# EAGLE design RFID_USB_Reader-v18 (EAGLE 9.1.0)
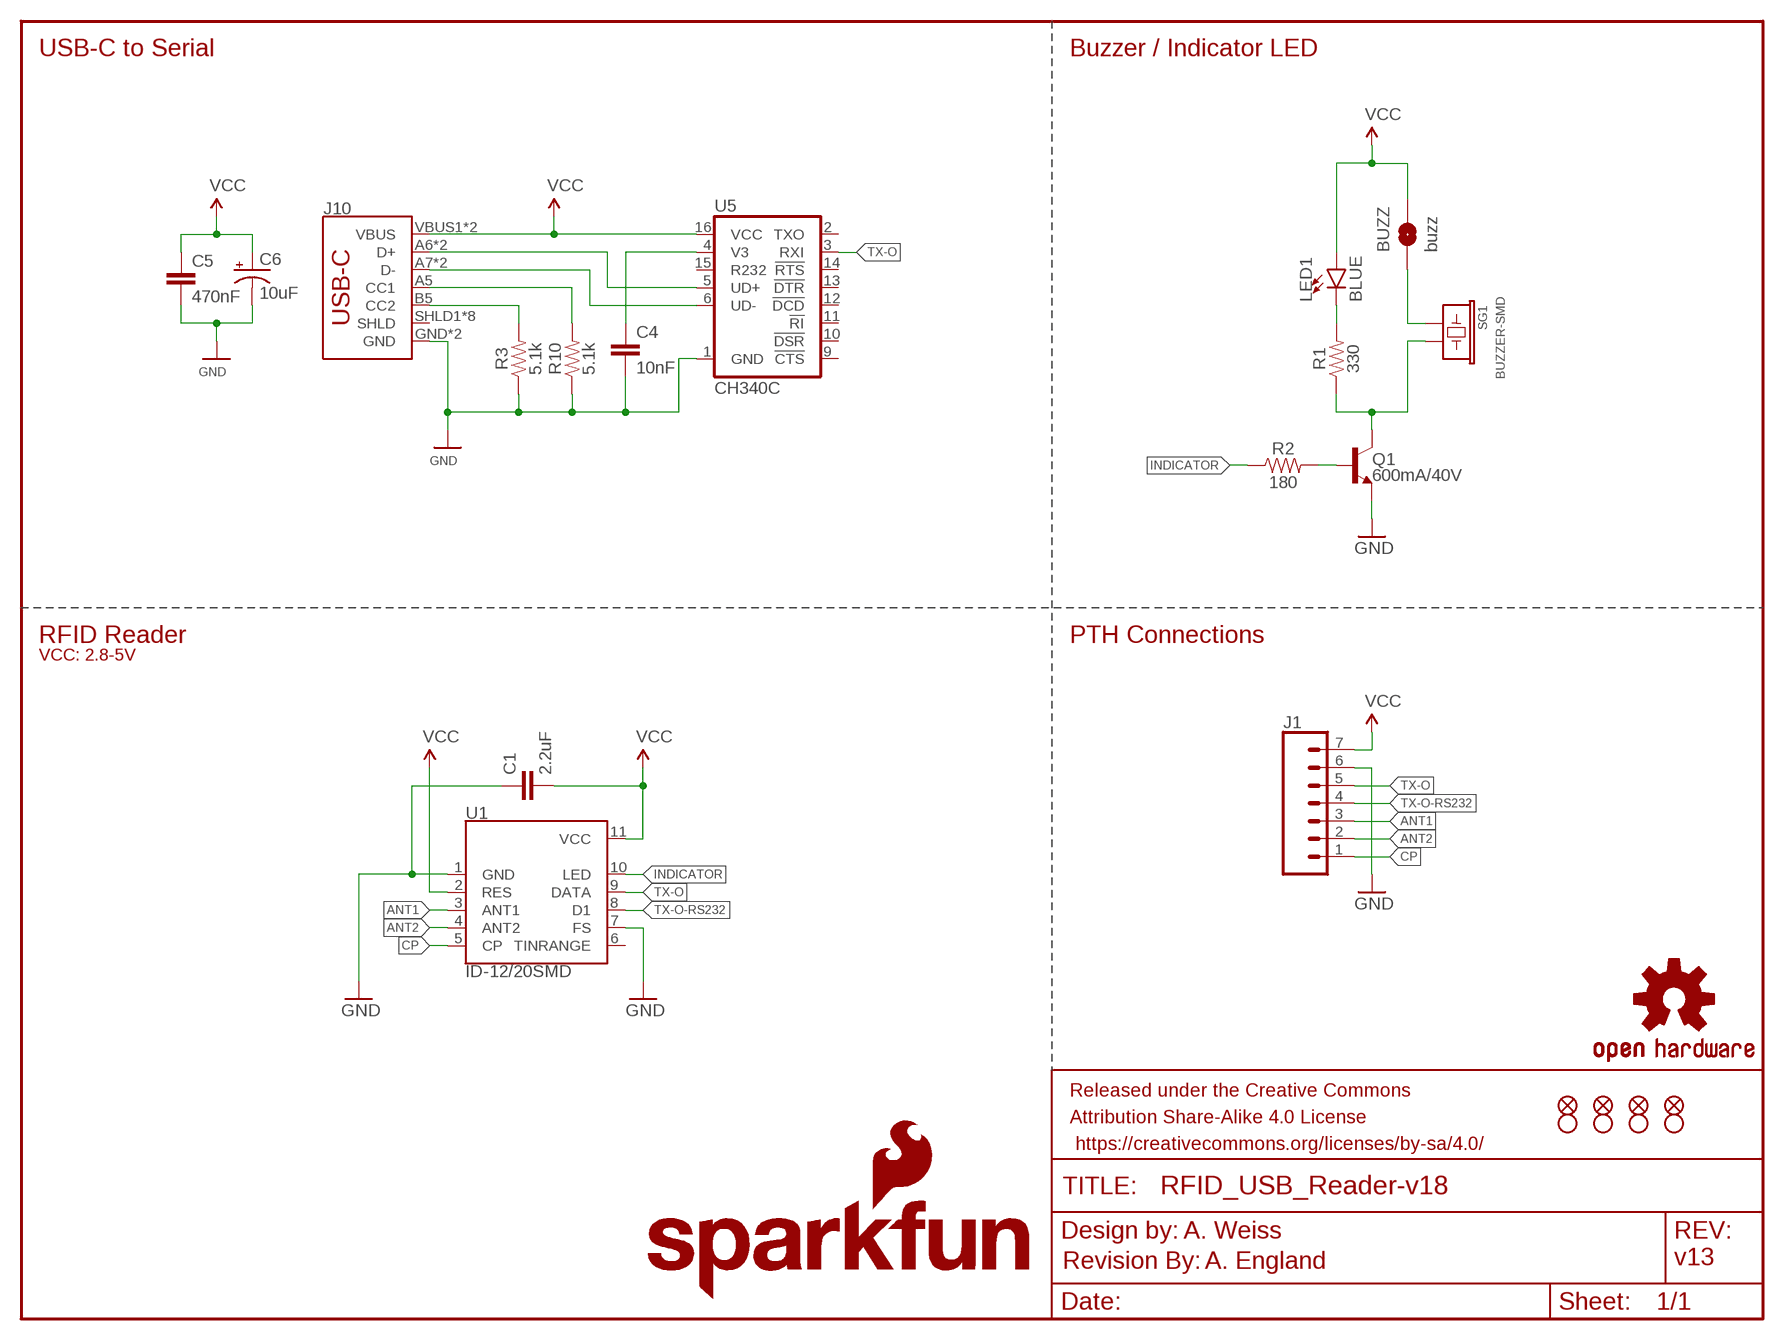
[diagram p0: schematic, sheet 1]

## Parts
BUZZ  buzz  JUMPER-SMT_2_NO_NO-SILK  [SMT-JUMPER_2_NO_NO-SILK]
C1  2.2uF  2.2UF-0603-10V-20%  [0603]
C4  10nF  10NF-0603-50V-10%  [0603]
C5  470nF  470NF-0603-10V-10%-X5R  [0603]
C6  10uF  10UF-POLAR-0603-6.3V-20%(TANT)  [0603-POLAR]
FRAME1  FRAME-LETTER  [CREATIVE_COMMONS]
J1  CONN_07  [1X07]
J10  USB_C2-LAYER  [USB-C-16P]
JP1  FIDUCIAL1X2  [FIDUCIAL-1X2]
JP2  FIDUCIAL1X2  [FIDUCIAL-1X2]
JP3  FIDUCIAL1X2  [FIDUCIAL-1X2]
JP5  FIDUCIAL1X2  [FIDUCIAL-1X2]
LED1  BLUE  LED-BLUE0603  [LED-0603]
LOGO1  SFE_LOGO_NAME_FLAME.1_INCH  [SFE_LOGO_NAME_FLAME_.1]
LOGO2  SFE_LOGO_NAME_FLAME.1_INCH  [SFE_LOGO_NAME_FLAME_.1]
LOGO3  OSHW-LOGOS  [OSHW-LOGO-S]
LOGO4  REVISION  [REVISION]
Q1  600mA/40V  TRANS_NPN-MMBT2222AL  [SOT23-3]
R1  330  330OHM-0603-1/10W-1%  [0603]
R2  180  180OHM-0603-1/10W-1%  [0603]
R3  5.1k  5.1KOHM5.1KOHM-0603-1/10W-1%  [0603]
R10  5.1k  5.1KOHM5.1KOHM-0603-1/10W-1%  [0603]
SG1  BUZZER-SMD  [BUZZER-CCV]
U1  ID-12/20SMD  [ID-12_SMD]
U5  CH340C  [SO016]
U$4  STAND-OFF  [STAND-OFF]
U$5  STAND-OFF  [STAND-OFF]
U$6  STAND-OFF  [STAND-OFF]
U$7  STAND-OFF  [STAND-OFF]

## Nets
ANT1: J1.3 U1.3(ANT1)
ANT2: J1.2 U1.4(ANT2)
CP: J1.1 U1.5(CP)
GND: C1.1 C4.2 C5.2 C6.- J1.6 J10.GND J10.GND2(GND) Q1.2(E) R3.1 R10.1 U1.1(GND) U1.7(FS) U5.1(GND)
INDICATOR: R2.1 U1.10(LED)
N$1: Q1.3(C) R1.1 SG1.-
N$2: C4.1 U5.4(V3)
N$3: J10.A6(D+) J10.B6(D+) U5.5(UD+)
N$4: BUZZ.1 SG1.+
N$6: J10.A5(CC1) R10.2
N$7: LED1.C R1.2
N$8: Q1.1(B) R2.2
N$9: J10.A7(D-) J10.B7(D-) U5.6(UD-)
N$11: J10.B5(CC2) R3.2
TX-O: J1.5 U1.9(DATA) U5.3(RXI)
TX-O-RS232: J1.4 U1.8(D1)
VCC: BUZZ.2 C1.2 C5.1 C6.+ J1.7 J10.VBUS1(VBUS) J10.VBUS2(VBUS) LED1.A U1.2(RES) U1.11(VCC) U5.16(VCC)
Unconnected: J10.SHLD1(SHLD) J10.SHLD2(SHLD) J10.SHLD3(SHLD) J10.SHLD4(SHLD) J10.SHLD5(SHLD) J10.SHLD6(SHLD) J10.SHLD7(SHLD) J10.SHLD8(SHLD) U1.6(TINRANGE) U5.2(TXO) U5.9(!CTS) U5.10(!DSR) U5.11(!RI) U5.12(!DCD) U5.13(!DTR) U5.14(!RTS) U5.15(R232)

## Notes on the sheet
- USB-C to Serial | Buzzer / Indicator LED
- RFID Reader | PTH Connections
- VCC: 2.8-5V
- A. Weiss
- A. England | v13

## Library data of the parts
BUZZ = SparkFun-Jumpers:JUMPER-SMT_2_NO: Normally open jumper This jumper has two pads in close proximity to each other. Apply solder to close the connection. Round pads are easier to solder for beginners, but are a lot larger. SparkFun Product that uses the round pads: SparkFun EL Sequencer <https://www.sparkfun.com/products/12781>
C1 = SparkFun-Capacitors:2.2UF: 2.2µF ceramic capacitors A capacitor is a passive two-terminal electrical component used to store electrical energy temporarily in an electric field.; PROD_ID: CAP-07888
C4 = SparkFun-Capacitors:10NF: 0.01uF/10nF/10,000pF ceramic capacitors A capacitor is a passive two-terminal electrical component used to store electrical energy temporarily in an electric field. CAP-09321; PROD_ID: CAP-00867
C5 = SparkFun-Capacitors:470NF: 0.47uF/470nF ceramic capacitors A capacitor is a passive two-terminal electrical component used to store electrical energy temporarily in an electric field.; PROD_ID: CAP-13216
C6 = SparkFun-Capacitors:10UF-POLAR: 10.0µF polarized capacitors A capacitor is a passive two-terminal electrical component used to store electrical energy temporarily in an electric field.; PROD_ID: CAP-13210
FRAME1 = SparkFun-Aesthetics:FRAME-LETTER: Schematic Frame - Letter Standard 8.5x11 US Letter frame
J1 = SparkFun-Connectors:CONN_07: Multi connection point. Often used as Generic Header-pin footprint for 0.1 inch spaced/style header connections On any of the 0.1 inch spaced packages, you can populate with these: Break Away Headers - Straight <https://www.sparkfun.com/products/116> (PRT-00116) Break Away Male Headers - Right Angle <https://www.sparkfun.com/products/553> (PRT-00553) Female Headers <https://www.sparkfun.com/products/115> (PRT-00115) Break Away Headers - Machine Pin <https://www.sparkfun.com/products/117> (PRT-00117) Break Away Female Headers - Swiss Machine Pin <https://www.sparkfun.com/products/743> (PRT-00743) For SCREWTERMINALS and SPRING TERMINALS visit here: Screw Terimnals on SparkFun.com <https://www.sparkfun.com/search/results?term=Screw+Terminals> (5mm/3.5mm/2.54mm spacing) This device is also useful as a general connection point to wire up your design to another part of your project. Our various solder wires solder well into these plated through hole pads. Hook-Up Wire - Assortment (Stranded, 22 AWG) <https://www.sparkfun.com/products/11375> (PRT-11375) Hook-Up Wire - Assortment (Solid Core, 22 AWG) <https://www.sparkfun.com/products/11367> (PRT-11367) View the entire wire category on our website here <https://www.sparkfun.com/categories/141> Special notes: Molex polarized connector foot print use with SKU : PRT-08231 with associated crimp pins and housings. 1MM SMD Version SKU: PRT-10208 NOTES ON THE VARIANTS LOCK and LOCK_LONGPADS... This footprint was designed to help hold the alignment of a through-hole component (i.e. 6-pin header) while soldering it into place. You may notice that each hole has been shifted either up or down by 0.005 of an inch from it's more standard position (which is a perfectly straight line). This slight alteration caused the pins (the squares in the middle) to touch the edges of the holes. Because they are alternating, it causes a "brace" to hold the component in place. 0.005 has proven to be the perfect amount of "off-center" position when using our standard breakaway headers. Although looks a little odd when you look at the bare footprint, once you have a header in there, the alteration is very hard to notice. Also,if you push a header all the way into place, it is covered up entirely on the bottom side.
J10 = SparkFun-Connectors:USB_C: USB Type C 16Pin Connector Super Speed pins not available on the 16-pin purely SMD connector so this part is best for USB 2.0 implementations. D1 and D2 are tied together enabling D+/- no matter which way the cable is plugged into the connector. The two channel configuration pins (CC1/2) are exposed. These are normally connected to ground via 5.1k resistors but can be reconfigured for high current/high power applications.; PROD_ID: CONN-14122
JP1-JP3 JP5 = SparkFun:FIDUCIAL: Fiducial Alignment Points Various fiducial points for machine vision alignment.
LED1 = SparkFun-LED:LED-BLUE: Blue SMD LED Used in manufacturing of various products at SparkFun Packages: 0603 - SMD 0603 package [Product Link] <http://www.digikey.com/product-detail/en/SMLE12BC7TT86/511-1589-2-ND/1641808> 1206 - SMD1206 package [Product Link] <http://www.digikey.com/product-detail/en/lite-on-inc/LTST-C150TBKT/160-1643-1-ND/573584> SparkFun Products: ESP8266 Thing-Dev Board <https://www.sparkfun.com/products/13711> RedBoard <https://www.sparkfun.com/products/12757>; PROD_ID: DIO-08575
LOGO1 LOGO2 = SparkFun-Aesthetics:SFE_LOGO_NAME_FLAME: SparkFun Font Logo w/ Flame This is the SparkFun full logo. The logo on the schematic will always be the same size; the package variant is the height of the flame part of the logo. Default layer for the logo on the board is tSilk.
LOGO3 = SparkFun-Aesthetics:OSHW-LOGO: Open-Source Hardware (OSHW) Logo This logo indicates the piece of hardware it is found on incorporates a OSHW license and/or adheres to the definition of open source hardware found here: http://freedomdefined.org/OSHW
LOGO4 = SparkFun-Aesthetics:REVISION: "Revision By" Text Preceding text for revisor documentation. Includes schematic text on "symbols" layer, and board text on tDoc.
Q1 = SparkFun-DiscreteSemi:TRANS_NPN: NPN transistor Current controlled devices typically used to amplify current or used as a switch. BC547 - COM-08928 <http://www.sparkfun.com/products/8928> (TO-92 45V 100mA) (1.Collector 2.Base 3.Emitter) 2N3904 - COM-00521 <http://www.sparkfun.com/products/521> (TO-92 40V 200mA) (1.Emitter 2.Base 3.Collector) P2N2222A - COM-12852 <http://www.sparkfun.com/products/12852> (TO-92 40V 600mA) (1.Collector 2.Base 3.Emitter); PROD_ID: TRANS-08049
R1 = SparkFun-Resistors:330OHM: 330Ω resistor A resistor is a passive two-terminal electrical component that implements electrical resistance as a circuit element. Resistors act to reduce current flow, and, at the same time, act to lower voltage levels within circuits. - Wikipedia; PROD_ID: RES-00818
R2 = SparkFun-Resistors:180OHM: 180Ω resistor A resistor is a passive two-terminal electrical component that implements electrical resistance as a circuit element. Resistors act to reduce current flow, and, at the same time, act to lower voltage levels within circuits. - Wikipedia; PROD_ID: RES-08788
R3 R10 = SparkFun-Resistors:5.1KOHM; PROD_ID: RES-12083
SG1 = SparkFun-Electromechanical:BUZZER: Buzzer Small round buzzers that operate around the audible 2kHz range. You can use these as speakers to create simple music or user interfaces. Variant Overview: PTH - Mini Speaker - PC Mount 12mm 2.048kHz <https://www.sparkfun.com/products/7950> PTH_KIT - Mini Speaker - PC Mount 12mm 2.048kHz <https://www.sparkfun.com/products/7950> KIT simplifies soldering by adding stop mask to one side of the pads. PTH_NO_SILK - Mini Speaker - PC Mount 12mm 2.048kHz <https://www.sparkfun.com/products/7950> No silkscreen indicator of buzzer outline. PTH_KIT_NO_SILK - Mini Speaker - PC Mount 12mm 2.048kHz <https://www.sparkfun.com/products/7950> KIT package w/o silkscreen SMD - Buzzer Audio Magnetic (CCV-084B16) SMD buzzer used on, e.g. the LilyPad Buzzer <https://www.sparkfun.com/products/8463> and RFID USB Reader <https://www.sparkfun.com/products/9963>. SMD_KIT - Buzzer Audio Magnetic (CCV-084B16) SMD Buzzer with elongated pins to make soldering easier. Used on the SparkFun Simon Says - Surface Mount Soldering Kit <https://www.sparkfun.com/products/10935>.; PROD_ID: COMP-08568
U1 = SparkFun-RF:ID-12/20: ID Innovations 125kHz RFID Reader (ID2, ID3, ID12, and ID20) The IDS, ID3, ID12, and ID20 are very simple to use RFID reader modules. Power the module, hold up a 125kHz card, and get a serial string output containing the unique ID of the card. SparkFun Products RFID Reader ID-3LA (125 kHz) <https://www.sparkfun.com/products/11862> (SEN-11862) RFID Reader ID-12LA (125 kHz) <https://www.sparkfun.com/products/11827> (SEN-11827) RFID Reader ID-20LA (125 kHz) <https://www.sparkfun.com/products/11828> (SEN-11828) SparkFun RFID USB Reader <https://www.sparkfun.com/products/9963> (SEN-9963); PROD_ID: CONN-09345, CONN-09344
U5 = SparkFun-IC-Comms:CH340C; PROD_ID: IC-14038
U$4-U$7 = SparkFun:STAND-OFF: Stand Off This is the mechanical footprint for a #4 phillips button head screw. Use the keepout ring to avoid running the screw head into surrounding components. SKU : PRT-00447

## Board
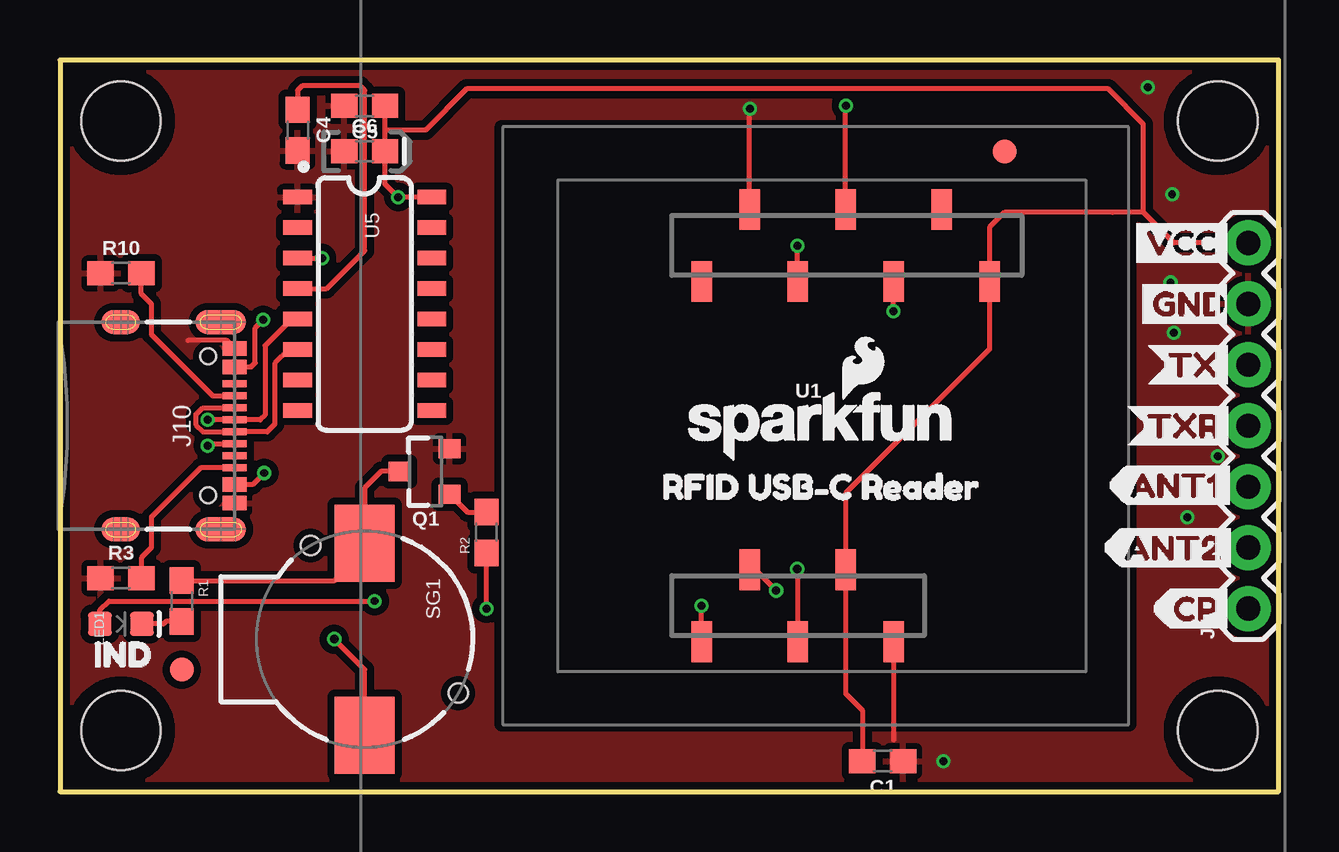
[diagram p1: board, top side]
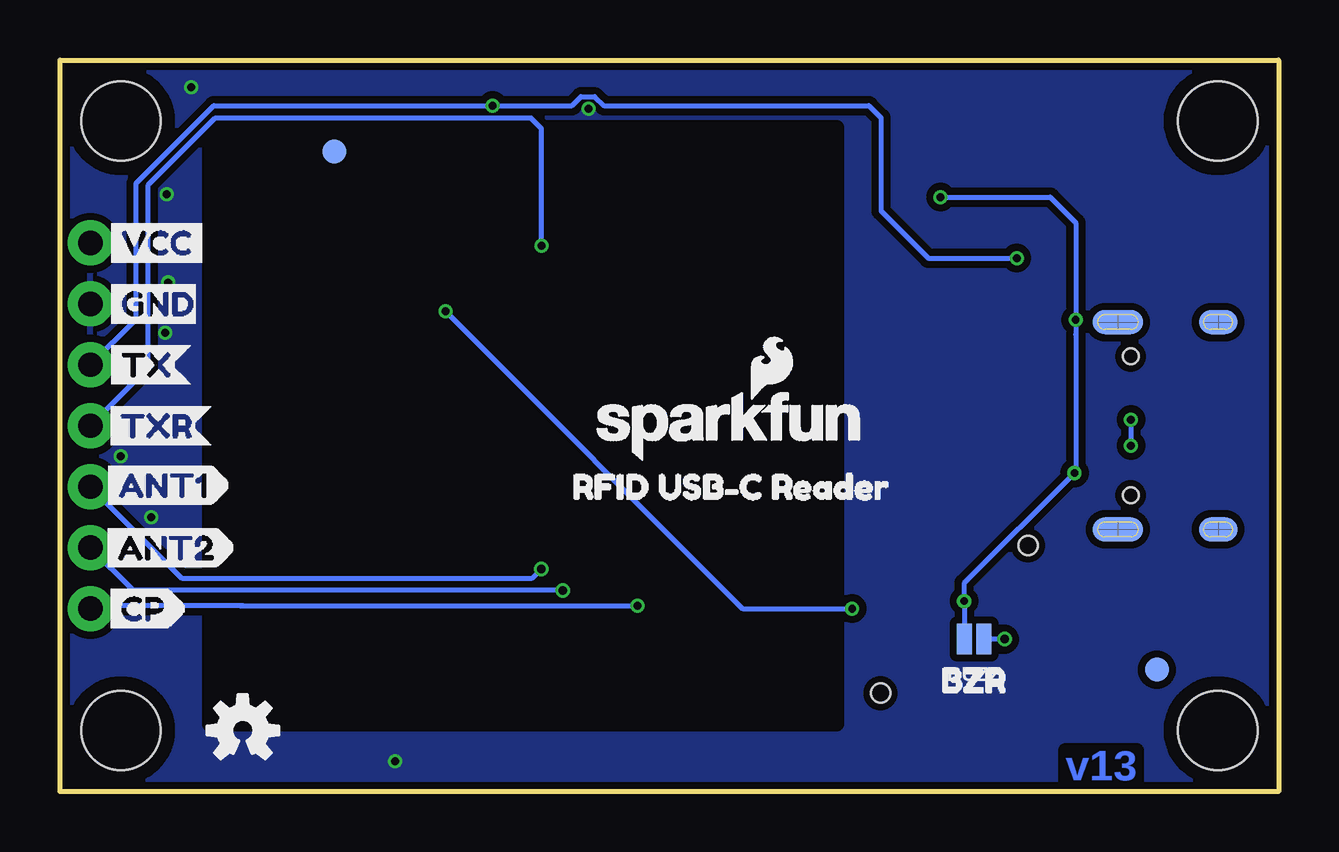
[diagram p2: board, bottom side, seen from below]

Size 50.8 x 30.48 mm. Coordinates in mm from the lower left corner, seen from the top.
Outline: 0,0 50.8,0 50.8,30.48 0,30.48 0,0
Copper layers (1*16): Top 0.035mm / dielectric 1.5mm / Bottom 0.035mm
Design rules "SparkFun-2-layer-FAB-LIMIT": minimum track width 4mil, minimum drill 6mil, track to track 4mil, track to pad 4mil, pad to pad 4mil, via to via 4mil, smd to smd 4mil, copper to edge 4mil, drill to drill 4mil, minimum pad ring 5mil, minimum via ring 5mil, stop-mask expansion 4mil, vias tented up to drill 25mil, thermal gap 10mil

### Footprints (pad centres in the part's own frame; a part is rotated, then mirrored left to right if it is on the bottom)
SMT-JUMPER_2_NO_NO-SILK = smd 0.635 x 1.27: 1 -0.406,0; 2 0.406,0
0603 = smd 1.1 x 1: 1 -0.85,0; 2 0.85,0
0603-POLAR = smd 1.1 x 1: + 0.85,0; - -0.85,0
1X07 = drill 1.016 pad 1.88: 1 0,0; 2 2.54,0; 3 5.08,0; 4 7.62,0; 5 10.16,0; 6 12.7,0; 7 15.24,0
USB-C-16P = smd 0.3 x 1: A5 -1.25,-0.34; A6 -0.25,-0.34; A7 0.25,-0.34; A8 1.25,-0.34; B5 1.75,-0.34; B6 0.75,-0.34; B7 -0.75,-0.34; B8 -1.75,-0.34 | smd 0.6 x 1: GND -3.225,-0.34; GND2 3.225,-0.34; VBUS1 -2.45,-0.34; VBUS2 2.45,-0.34 | smd 1 x 2.1: SHLD1 -4.32,-0.915; SHLD2 4.32,-0.915 | smd 1 x 2.1 bottom: SHLD3 -4.32,-0.915; SHLD4 4.32,-0.915 | smd 1 x 1.6: SHLD5 -4.32,-5.095; SHLD8 4.32,-5.095 | smd 1 x 1.6 bottom: SHLD6 -4.32,-5.095; SHLD7 4.32,-5.095 | hole 0.65: -2.89,-1.445; 2.89,-1.445
FIDUCIAL-1X2 = smd 1 x 1: 1 0,0
LED-0603 = smd 1 x 1: A -0.877,0; C 0.877,0
SOT23-3 = smd 0.8 x 0.9: 1 -0.95,-1; 2 0.95,-1; 3 0,1.1
BUZZER-CCV = smd 3.2 x 2.5: + 4,0; - -4,0 | hole 0.8: -3.9,-2.25; 2.25,3.9
ID-12_SMD = smd 0.85 x 1.7: 1 2.993,-8.998; 2 0.993,-5.998; 3 -1.007,-8.998; 4 -3.007,-5.998; 5 -5.007,-8.998; 6 -5.007,6.013; 7 -3.007,9.013; 8 -1.007,6.013; 9 0.993,9.013; 10 2.993,6.013; 11 6.993,6.013; NC 4.993,9.013
SO016 = smd 0.6 x 1.2: 1 -4.445,-2.8; 2 -3.175,-2.8; 3 -1.905,-2.8; 4 -0.635,-2.8; 5 0.635,-2.8; 6 1.905,-2.8; 7 3.175,-2.8; 8 4.445,-2.8; 9 4.445,2.8; 10 3.175,2.8; 11 1.905,2.8; 12 0.635,2.8; 13 -0.635,2.8; 14 -1.905,2.8; 15 -3.175,2.8; 16 -4.445,2.8
STAND-OFF = hole 3.302: 0,0

### Placement (x,y rotation side)
BUZZ  12.7,6.35 180 bottom
C1  34.29,1.27 180 top
C4  9.91,27.56 270 top
C5  12.7,28.57 180 top
C6  12.7,26.67 0 top
FRAME1  -3.28,-12.7 0 top  (outside the outline)
J1  49.53,7.62 90 top
J10  7.62,15.24 270 top
JP1  39.37,26.67 0 bottom
JP2  5.08,5.08 0 top
JP3  39.37,26.67 0 top
JP5  5.08,5.08 0 bottom
LED1  2.54,6.99 0 top
LOGO1  31.75,15.24 0 top
LOGO2  22.86,15.24 0 bottom
LOGO3  43.18,2.54 0 bottom
LOGO4  8.89,-15.24 0 top  (outside the outline)
Q1  15.24,13.34 90 top
R1  5.08,7.94 270 top
R2  17.78,10.79 90 top
R3  2.54,8.89 0 top
R10  2.54,21.59 0 top
SG1  12.7,6.35 270 top
U1  31.75,15.24 0 top
U5  12.7,20.32 270 top
U$1  [CP5]  45.47,7.62 0 top
U$3  [GND1]  44.64,20.32 0 top
U$4  2.54,27.94 0 top
U$5  2.54,2.54 0 top
U$6  48.26,27.94 0 top
U$7  48.26,2.54 0 top
U$8  [BZR3]  14.99,4.64 0 bottom
U$9  [TX3]  45.28,17.78 0 top
U$10  [TXR4]  44.39,15.24 0 top
U$11  [VCC0]  44.39,22.86 0 top
U$12  [VCC0]  49.15,22.86 0 bottom
U$13  [GND1]  49.15,20.32 0 bottom
U$14  [TX0]  49.15,17.78 0 bottom
U$15  [TXR1]  49.21,15.24 0 bottom
U$16  [CP2]  49.21,7.62 0 bottom
U$17  [RFID_USB#C_READER0]  24.19,12.7 0 top
U$18  [RFID_USB#C_READER0]  30.35,12.7 0 bottom
U$19  [ANT11]  43.69,12.76 0 top
U$20  [ANT13]  49.28,12.76 0 bottom
U$21  [ANT22]  43.43,10.16 0 top
U$22  [ANT24]  49.34,10.16 0 bottom
U$23  [IND0]  0.51,5.71 0 top

### Tracks (layer width: path | path; a pad name or v marks a point on that pad's centre or on a via)
ANT1  (via drill 0.35)
  Top 0.203: v30.73,9.27 30.73,6.25 U1.3
  Bottom 0.203: J1.3 45.72,8.89 31.11,8.89 v30.73,9.27
ANT2  (via drill 0.35)
  Top 0.203: U1.4 28.98,9.24 v29.84,8.38
  Bottom 0.203: J1.2 47.75,8.38 v29.84,8.38
CP  (via drill 0.33)
  Top 0.203: U1.5 26.74,7.74 v26.73,7.75
  Bottom 0.203: 43.31,7.75 43.18,7.75 | 43.18,7.75 v26.73,7.75 | 43.18,7.75 49.4,7.75 J1.1
GND  (via drill 0.33)
  Top 0.203: J10.GND 6.95,18.79 5.34,18.79 | U1.7 28.74,28.45 v28.77,28.45 | U1.1 34.74,2.15
  other vias: 48.26,13.97 46.99,11.43 46.42,19.11 46.35,24.89 46.29,21.21 45.34,29.34 36.83,1.27
  pour Top (isolate 0.305): 0,30.48 0,0 50.8,0 50.8,30.48
  pour Bottom (isolate 0.305): 0,30.48 0,0 50.8,0 50.8,30.48
INDICATOR  (via drill 0.33)
  Top 0.203: v17.78,7.62 R2.1 | v34.73,20 U1.10
  Bottom 0.203: v34.73,20 22.35,7.62 v17.78,7.62
N$1
  Top 0.203: R1.1 11.45,8.79 12.7,10.03 SG1.- 12.7,12.66 13.38,13.34 Q1.3
N$2
  Top 0.203: U5.4 11.11,20.95 12.7,22.54 12.7,29.21 12.51,29.4 10.1,29.4 9.91,29.21 C4.1
N$3  (via drill 0.33)
  Top 0.203: U5.5 9.65,19.68 8.55,18.58 8.55,15.68 8.35,15.49 J10.A6 v6.16,15.49 | v6.16,14.41 6.24,14.49 J10.B6
  Bottom 0.203: v6.16,15.49 v6.16,14.41
N$4  (via drill 0.35)
  Top 0.203: SG1.+ 12.7,5.08 v11.43,6.35
  Bottom 0.203: v11.43,6.35 BUZZ.1
N$6
  Top 0.203: R10.2 3.39,20.74 3.81,20.32 3.81,19.05 6.37,16.49 J10.A5
N$7
  Top 0.203: R1.2 4.42,7.09 4.32,6.99 LED1.C
N$8
  Top 0.203: Q1.1 16.98,11.64 R2.2
N$9
  Top 0.203: U5.6 9.53,18.41 8.95,17.84 8.95,15.3 8.64,14.99 J10.A7 5.96,14.99 5.66,15.29 5.66,15.7 5.95,15.99 J10.B7
N$11
  Top 0.203: J10.B5 5.87,13.49 3.81,11.43 3.81,10.16 3.39,9.74 R3.2
TX-O  (via drill 0.33)
  Top 0.203: U5.3 v10.92,22.23 | U1.9 32.74,28.55 v32.77,28.57
  Bottom 0.203: v10.92,22.23 14.61,22.23 16.57,24.19 16.57,28.07 17.08,28.57 28.13,28.57 28.51,28.96 29.08,28.96 29.46,28.57 v32.77,28.57 44.39,28.57 47.62,25.34 47.62,19.68 J1.5
TX-O-RS232  (via drill 0.33)
  Top 0.203: U1.8 30.74,22.72 v30.73,22.73
  Bottom 0.203: v30.73,22.73 30.73,27.62 31.18,28.07 44.32,28.07 47.12,25.27 47.12,17.65 J1.4
VCC  (via drill 0.33)
  Top 0.203: J10.VBUS1 7.97,17.69 8.14,17.86 8.14,19.32 v8.47,19.65 | v8.51,13.27 8.03,12.79 J10.VBUS2 | 13.55,27.62 C6.+ 13.55,25.31 v14.1,24.77 U5.16 | 13.55,27.62 C5.1 | 13.55,27.62 13.61,27.56 15.24,27.56 16.95,29.27 43.69,29.27 45.15,27.81 45.15,24.13 | 45.15,24.13 43.88,24.13 39.37,24.13 38.74,23.5 U1.11 38.74,18.42 32.74,12.42 U1.2 32.74,4.09 33.44,3.39 C1.2 | LED1.A 1.66,7.57 2.03,7.94 v13.11,7.94 | 45.15,24.13 46.42,22.86 J1.7
  Bottom 0.203: v8.47,19.65 8.47,19.05 | 8.47,19.05 8.47,13.31 v8.51,13.27 13.11,8.67 v13.11,7.94 v13.11,7.93 BUZZ.2 | v14.1,24.77 9.53,24.77 8.47,23.71 8.47,19.05

### Text on the board
Bottom: v13
tDocu: A. Weiss | A. England